# EAGLE design Schematic (EAGLE 5.09)
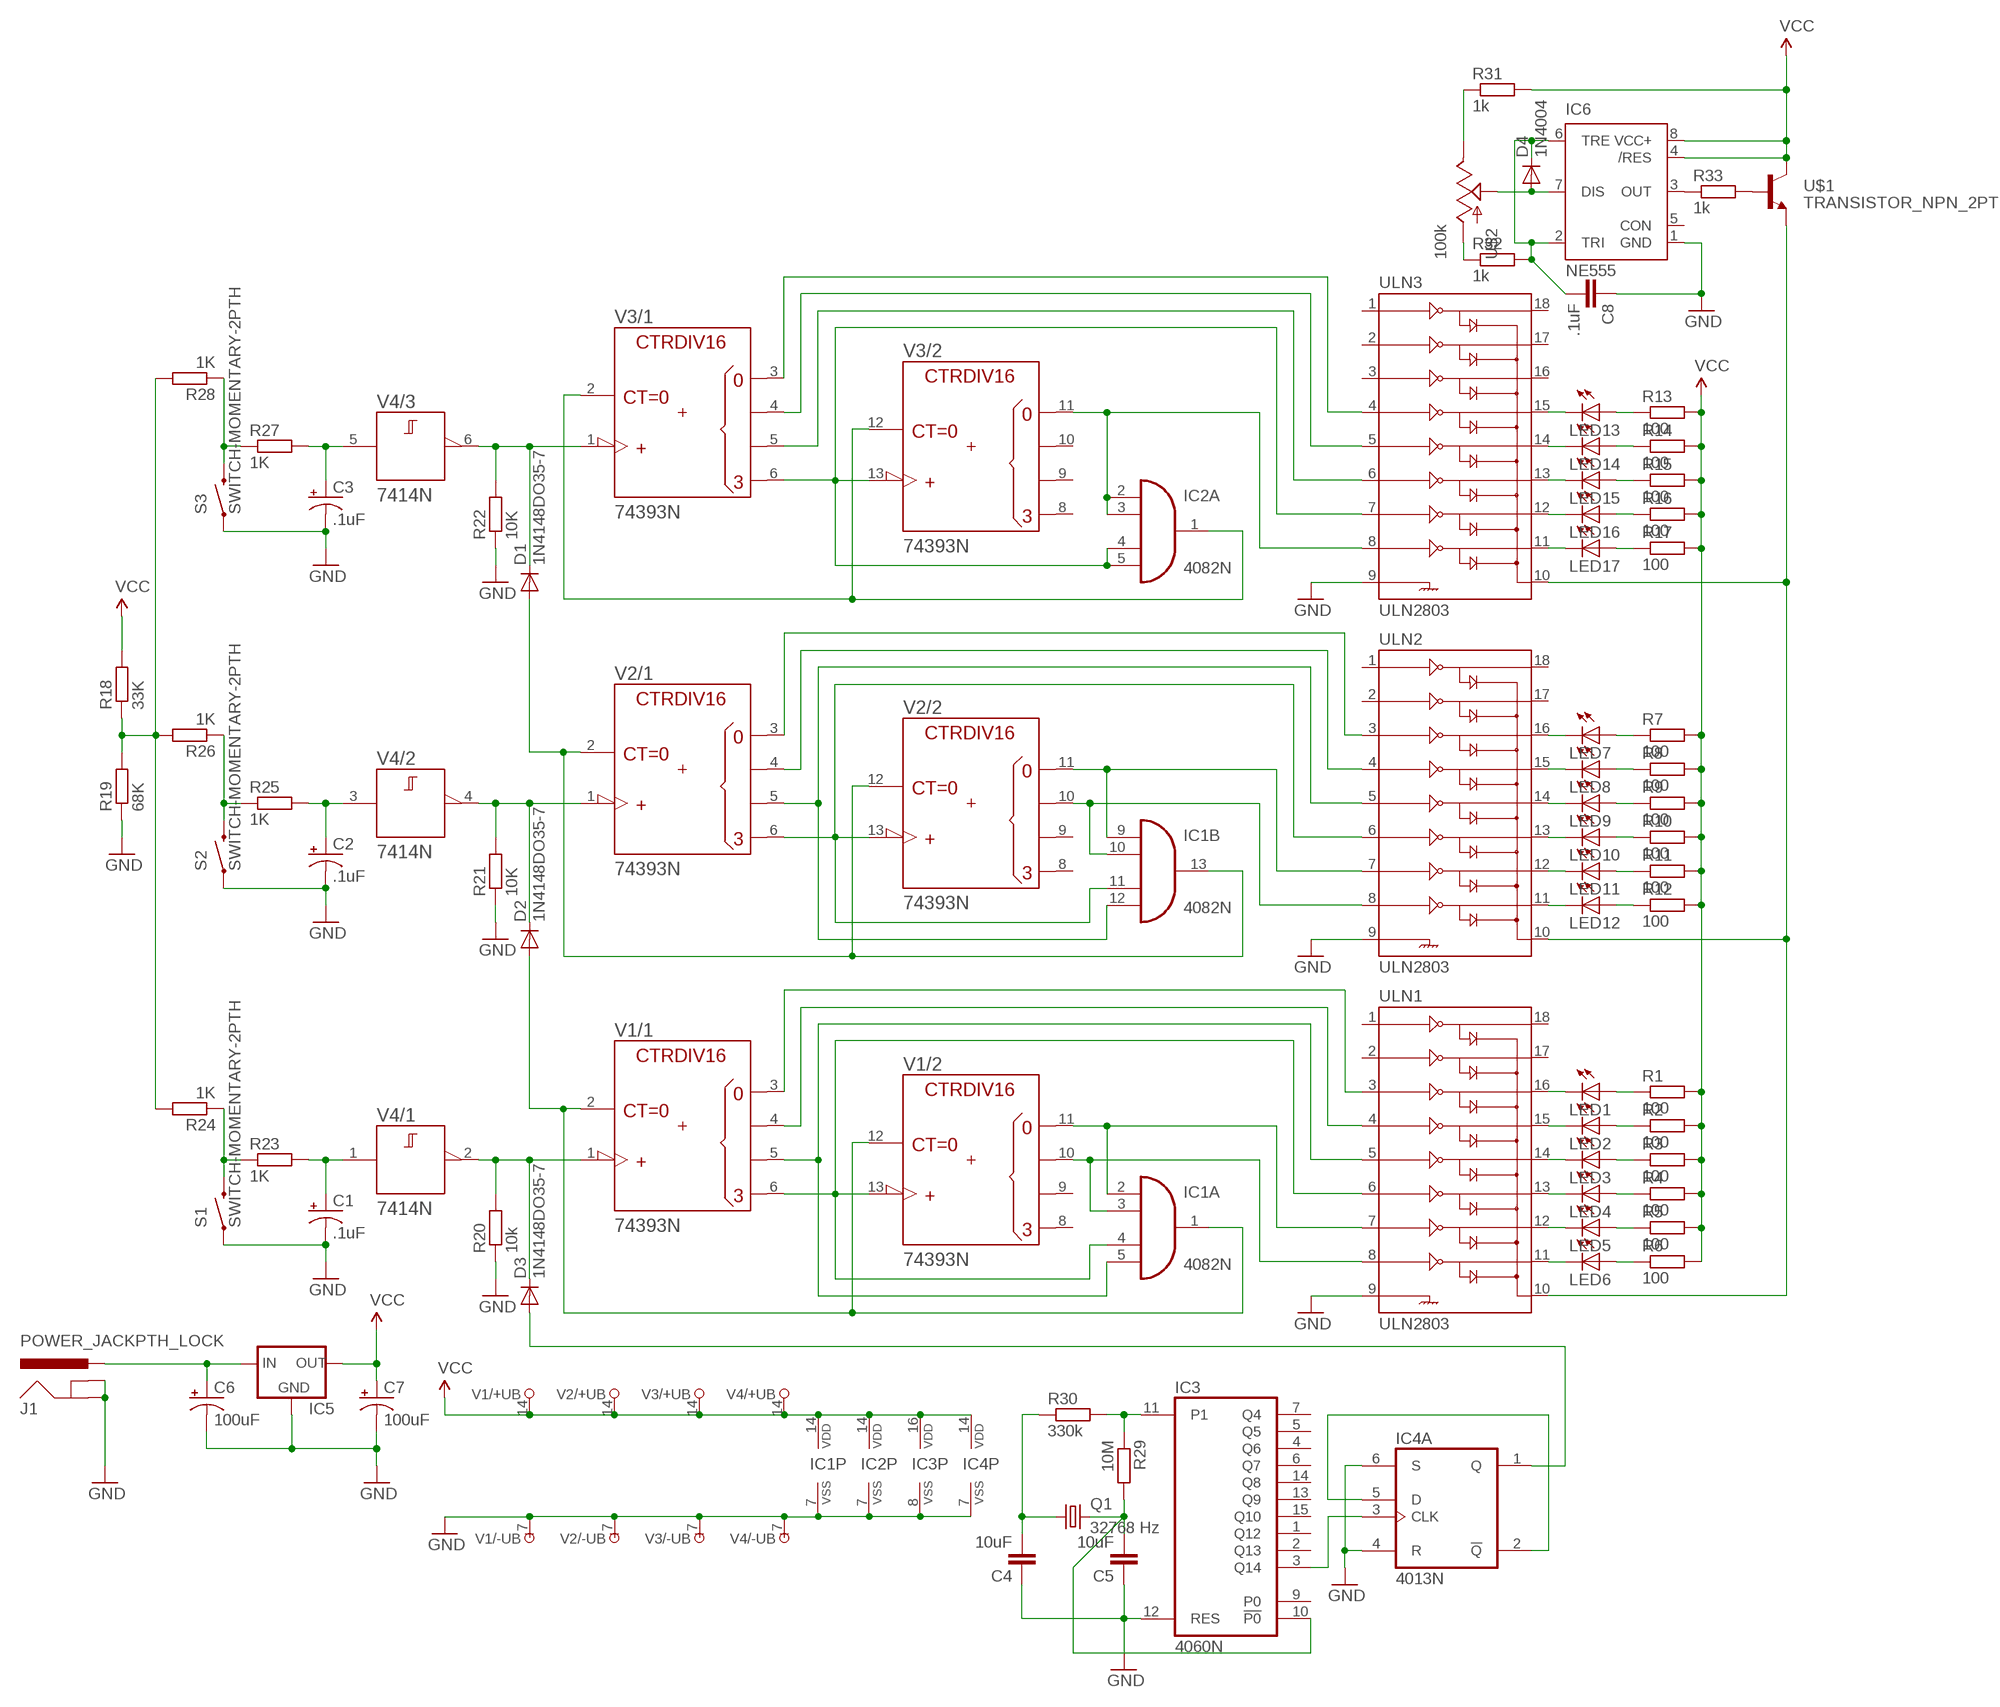
[diagram p0: schematic, sheet 1]

## Parts
C1  .1uF  CAP_POLPTH2  [CPOL-RADIAL-10UF-25V]
C2  .1uF  CAP_POLPTH2  [CPOL-RADIAL-10UF-25V]
C3  .1uF  CAP_POLPTH2  [CPOL-RADIAL-10UF-25V]
C4  10uF  CAPPTH  [CAP-PTH-SMALL]
C5  10uF  CAPPTH  [CAP-PTH-SMALL]
C6  100uF  CAP_POLPTH1  [CPOL-RADIAL-100UF-25V]
C7  100uF  CAP_POLPTH1  [CPOL-RADIAL-100UF-25V]
C8  .1uF  CAPPTH  [CAP-PTH-SMALL]
D1  1N4148DO35-7  DIODE-D-5  [D-5]
D2  1N4148DO35-7  DIODE-D-5  [D-5]
D3  1N4148DO35-7  DIODE-D-5  [D-5]
D4  1N4004  DIODE-D-5  [D-5]
IC1  4082N  [DIL14]
IC2  4082N  [DIL14]
IC3  4060N  [DIL16]
IC4  4013N  [DIL14]
IC5  V_REG_78XXSIDE  [78XXL]
IC6  NE555  [DIL-08]
J1  POWER_JACKPTH_LOCK  [POWER_JACK_PTH_LOCK]
LED1  LED5MM  [LED5MM]
LED2  LED5MM  [LED5MM]
LED3  LED5MM  [LED5MM]
LED4  LED5MM  [LED5MM]
LED5  LED5MM  [LED5MM]
LED6  LED5MM  [LED5MM]
LED7  LED5MM  [LED5MM]
LED8  LED5MM  [LED5MM]
LED9  LED5MM  [LED5MM]
LED10  LED5MM  [LED5MM]
LED11  LED5MM  [LED5MM]
LED12  LED5MM  [LED5MM]
LED13  LED5MM  [LED5MM]
LED14  LED5MM  [LED5MM]
LED15  LED5MM  [LED5MM]
LED16  LED5MM  [LED5MM]
LED17  LED5MM  [LED5MM]
Q1  32768 Hz  CRYSTALTC26V  [TC26V]
R1  100  R-EU_0204/7  [0204/7]
R2  100  R-EU_0204/7  [0204/7]
R3  100  R-EU_0204/7  [0204/7]
R4  100  R-EU_0204/7  [0204/7]
R5  100  R-EU_0204/7  [0204/7]
R6  100  R-EU_0204/7  [0204/7]
R7  100  R-EU_0204/7  [0204/7]
R8  100  R-EU_0204/7  [0204/7]
R9  100  R-EU_0204/7  [0204/7]
R10  100  R-EU_0204/7  [0204/7]
R11  100  R-EU_0204/7  [0204/7]
R12  100  R-EU_0204/7  [0204/7]
R13  100  R-EU_0204/7  [0204/7]
R14  100  R-EU_0204/7  [0204/7]
R15  100  R-EU_0204/7  [0204/7]
R16  100  R-EU_0204/7  [0204/7]
R17  100  R-EU_0204/7  [0204/7]
R18  33K  R-EU_0204/7  [0204/7]
R19  68K  R-EU_0204/7  [0204/7]
R20  10k  R-EU_0204/7  [0204/7]
R21  10K  R-EU_0204/7  [0204/7]
R22  10K  R-EU_0204/7  [0204/7]
R23  1K  R-EU_0204/7  [0204/7]
R24  1K  R-EU_0204/7  [0204/7]
R25  1K  R-EU_0204/7  [0204/7]
R26  1K  R-EU_0204/7  [0204/7]
R27  1K  R-EU_0204/7  [0204/7]
R28  1K  R-EU_0204/7  [0204/7]
R29  10M  R-EU_0204/7  [0204/7]
R30  330k  R-EU_0204/7  [0204/7]
R31  1k  R-EU_0204/7  [0204/7]
R32  1k  R-EU_0204/7  [0204/7]
R33  1k  R-EU_0204/7  [0204/7]
S1  SWITCH-MOMENTARY-2PTH  [TACTILE-PTH]
S2  SWITCH-MOMENTARY-2PTH  [TACTILE-PTH]
S3  SWITCH-MOMENTARY-2PTH  [TACTILE-PTH]
U$1  TRANSISTOR_NPN_2PTH  [TO-92]
U$2  100k  POT  [ALPS_POT]
ULN1  ULN2803  ULN2803DIP  [DIL18]
ULN2  ULN2803  ULN2803DIP  [DIL18]
ULN3  ULN2803  ULN2803DIP  [DIL18]
V1  74393N  [DIL14]
V2  74393N  [DIL14]
V3  74393N  [DIL14]
V4  7414N  [DIL14]

## Nets
GND: C1.2(-) C2.2(-) C3.2(-) C4.1 C5.1 C6.2(-) C7.2(-) C8.1 IC1.7(P:VSS) IC2.7(P:VSS) IC3.8(VSS) IC3.12(RES) IC4.4(A:R) IC4.6(A:S) IC4.7(P:VSS) IC5.GND IC6.1(GND) J1.GND J1.GNDBREAK R19.1 R20.1 R21.1 R22.1 S1.1 S2.1 S3.1 ULN1.9 ULN2.9 ULN3.9 V1.7(/-UB:-UB) V2.7(/-UB:-UB) V3.7(/-UB:-UB) V4.7(/-UB:-UB)
N$1: IC1.2(A:I0) ULN1.7 V1.11(/2:QA)
N$2: ULN1.3 V1.3(/1:QA)
N$3: IC1.5(A:I3) ULN1.5 V1.5(/1:QC)
N$4: IC1.3(A:I1) ULN1.8 V1.10(/2:QB)
N$5: R31.1 U$2.P$1(E)
N$6: LED2.A R2.1
N$7: ULN2.4 V2.4(/1:QB)
N$8: ULN2.3 V2.3(/1:QA)
N$9: LED1.A R1.1
N$10: LED3.A R3.1
N$11: LED4.A R4.1
N$12: LED5.A R5.1
N$13: LED6.A R6.1
N$14: R25.1 R26.1 S2.3
N$15: IC1.12(B:I3) ULN2.5 V2.5(/1:QC)
N$16: IC1.11(B:I2) ULN2.6 V2.6(/1:QD) V2.13(/2:A)
N$17: IC1.9(B:I0) ULN2.7 V2.11(/2:QA)
N$18: LED17.K(C) ULN3.11
N$19: LED16.K(C) ULN3.12
N$20: IC1.10(B:I1) ULN2.8 V2.10(/2:QB)
N$21: LED15.K(C) ULN3.13
N$22: LED14.K(C) ULN3.14
N$23: LED13.K(C) ULN3.15
N$24: LED13.A R13.1
N$25: IC2.2(A:I0) IC2.3(A:I1) ULN3.8 V3.11(/2:QA)
N$26: ULN3.5 V3.4(/1:QB)
N$27: ULN3.6 V3.5(/1:QC)
N$28: R27.1 R28.1 S3.3
N$29: IC2.4(A:I2) IC2.5(A:I3) ULN3.7 V3.6(/1:QD) V3.13(/2:A)
N$30: LED14.A R14.1
N$31: ULN3.4 V3.3(/1:QA)
N$32: LED15.A R15.1
N$33: LED16.A R16.1
N$34: LED17.A R17.1
N$35: IC4.2(A:!Q) IC4.5(A:D)
N$36: LED7.K(C) ULN2.16
N$37: LED8.K(C) ULN2.15
N$38: LED9.K(C) ULN2.14
N$39: LED10.K(C) ULN2.13
N$40: LED11.K(C) ULN2.12
N$41: C2.1(+) R25.2 V4.3(/2:A)
N$42: IC3.3(Q14) IC4.3(A:CLK)
N$43: R18.1 R19.2 R24.2 R26.2 R28.2
N$44: R23.1 R24.1 S1.3
N$45: D2.C R21.2 V2.1(/1:A) V4.4(/2:Y)
N$46: IC3.11(P1) R29.1 R30.2
N$47: D2.A IC1.1(A:O) V1.2(/1:CLR) V1.12(/2:CLR)
N$48: C6.1(+) IC5.IN J1.PWR
N$49: D1.A IC1.13(B:O) V2.2(/1:CLR) V2.12(/2:CLR)
N$50: C3.1(+) R27.2 V4.5(/3:A)
N$51: C1.1(+) R23.2 V4.1(/1:A)
N$52: D3.A IC4.1(A:Q)
N$53: IC2.1(A:O) V3.2(/1:CLR) V3.12(/2:CLR)
N$54: LED12.K(C) ULN2.11
N$55: C5.2 IC3.10(!P0) Q1.2 R29.2
N$56: C4.2 Q1.1 R30.1
N$57: D1.C R22.2 V3.1(/1:A) V4.6(/3:Y)
N$58: IC1.4(A:I2) ULN1.6 V1.6(/1:QD) V1.13(/2:A)
N$59: D3.C R20.2 V1.1(/1:A) V4.2(/1:Y)
N$60: ULN1.4 V1.4(/1:QB)
N$61: LED7.A R7.1
N$62: LED8.A R8.1
N$63: LED9.A R9.1
N$64: LED10.A R10.1
N$65: LED11.A R11.1
N$66: LED12.A R12.1
N$67: R32.1 U$2.P$3(A)
N$69: D4.A IC6.7(DIS) U$2.P$2(S)
N$70: LED6.K(C) ULN1.11
N$71: LED5.K(C) ULN1.12
N$72: U$1.3(E) ULN1.10 ULN2.10 ULN3.10
N$74: LED4.K(C) ULN1.13
N$75: LED3.K(C) ULN1.14
N$76: LED2.K(C) ULN1.15
N$77: LED1.K(C) ULN1.16
N$78: R33.2 U$1.2(B)
N$80: IC6.3(OUT) R33.1
N$81: C8.2 D4.C IC6.2(TRI) IC6.6(TRE) R32.2
VCC: C7.1(+) IC1.14(P:VDD) IC2.14(P:VDD) IC3.16(VDD) IC4.14(P:VDD) IC5.OUT IC6.4(/RES) IC6.8(VCC+) R1.2 R2.2 R3.2 R4.2 R5.2 R6.2 R7.2 R8.2 R9.2 R10.2 R11.2 R12.2 R13.2 R14.2 R15.2 R16.2 R17.2 R18.2 R31.2 U$1.1(C) V1.14(/+UB:+UB) V2.14(/+UB:+UB) V3.14(/+UB:+UB) V4.14(/+UB:+UB)
Unconnected: IC2.9(B:I0) IC2.10(B:I1) IC2.11(B:I2) IC2.12(B:I3) IC2.13(B:O) IC3.1(Q12) IC3.2(Q13) IC3.4(Q6) IC3.5(Q5) IC3.6(Q7) IC3.7(Q4) IC3.9(P0) IC3.13(Q9) IC3.14(Q8) IC3.15(Q10) IC4.8(B:S) IC4.9(B:D) IC4.10(B:R) IC4.11(B:CLK) IC4.12(B:!Q) IC4.13(B:Q) IC6.5(CON) ULN1.1 ULN1.2 ULN1.17 ULN1.18 ULN2.1 ULN2.2 ULN2.17 ULN2.18 ULN3.1 ULN3.2 ULN3.3 ULN3.16 ULN3.17 ULN3.18 V1.8(/2:QD) V1.9(/2:QC) V2.8(/2:QD) V2.9(/2:QC) V3.8(/2:QD) V3.9(/2:QC) V3.10(/2:QB) V4.8(/4:Y) V4.9(/4:A) V4.10(/5:Y) V4.11(/5:A) V4.12(/6:Y) V4.13(/6:A)

## Library data of the parts
C1-C3 C6 C7 = SparkFun:CAP_POL: Capacitor Polarized These are standard SMD and PTH capacitors. Normally 10uF, 47uF, and 100uF in electrolytic and tantalum varieties. Always verify the external diameter of the through hole cap, it varies with capacity, voltage, and manufacturer. The EIA devices should be standard.
C4 C5 C8 = SparkFun:CAP: Capacitor Standard 0603 ceramic capacitor, and 0.1" leaded capacitor.
D1-D4 = diode:DIODE-: DIODE
IC1 IC2 = 40xx:4082: Dual 4-input AND
IC3 = 40xx:4060: 14-stage binary/ripple COUNTER
IC4 = 40xx:4013: Dual D FLIP FLOP, set/reset
IC5 = SparkFun:V_REG_78XX: Voltage Regulator Standard 7805 5V regulator. IGO (Input Ground Output). Spark Fun Electronics SKU : COM-00107
IC6 = st-microelectronics:NE555: General purpose bipolar Timer
J1 = SparkFun:POWER_JACK: Power Jack This is the standard 5.5mm barrel jack for power. The PTH is the most common, proven, reliable, footprint. All others are experimental. The Slot footprint only works if the mill layer is transmitted to the PCB fab house so be warned. Spark Fun Electronics SKU : PRT-00119. Mating wall wart : TOL-00298 (and others)
LED1-LED17 = led:LED: LED OSRAM: - CHIPLED LG R971, LG N971, LY N971, LG Q971, LY Q971, LO R971, LY R971 LH N974, LH R974 LS Q976, LO Q976, LY Q976 LO Q996 - Hyper CHIPLED LW Q18S LB Q993, LB Q99A, LB R99A - SideLED LS A670, LO A670, LY A670, LG A670, LP A670 LB A673, LV A673, LT A673, LW A673 LH A674 LY A675 LS A676, LA A676, LO A676, LY A676, LW A676 LS A679, LY A679, LG A679 - Hyper Micro SIDELED® LS Y876, LA Y876, LO Y876, LY Y876 LT Y87S - SmartLED LW L88C, LW L88S LB L89C, LB L89S, LG L890 LS L89K, LO L89K, LY L89K LS L896, LA L896, LO L896, LY L896 - TOPLED LS T670, LO T670, LY T670, LG T670, LP T670 LSG T670, LSP T670, LSY T670, LOP T670, LYG T670 LG T671, LOG T671, LSG T671 LB T673, LV T673, LT T673, LW T673 LH T674 LS T676, LA T676, LO T676, LY T676, LB T676, LH T676, LSB T676, LW T676 LB T67C, LV T67C, LT T67C, LS T67K, LO T67K, LY T67K, LW E67C LS E67B, LA E67B, LO E67B, LY E67B, LB E67C, LV E67C, LT E67C LW T67C LS T679, LY T679, LG T679 LS T770, LO T770, LY T770, LG T770, LP T770 LB T773, LV T773, LT T773, LW T773 LH T774 LS E675, LA E675, LY E675, LS T675 LS T776, LA T776, LO T776, LY T776, LB T776 LHGB T686 LT T68C, LB T68C - Hyper Mini TOPLED® LB M676 - Mini TOPLED Santana® LG M470 LS M47K, LO M47K, LY M47K Source: http://www.osram.convergy.de LUXEON: - LUMILED® LXK2-PW12-R00, LXK2-PW12-S00, LXK2-PW14-U00, LXK2-PW14-V00 LXK2-PM12-R00, LXK2-PM12-S00, LXK2-PM14-U00 LXK2-PE12-Q00, LXK2-PE12-R00, LXK2-PE12-S00, LXK2-PE14-T00, LXK2-PE14-U00 LXK2-PB12-K00, LXK2-PB12-L00, LXK2-PB12-M00, LXK2-PB14-N00, LXK2-PB14-P00, LXK2-PB14-Q00 LXK2-PR12-L00, LXK2-PR12-M00, LXK2-PR14-Q00, LXK2-PR14-R00 LXK2-PD12-Q00, LXK2-PD12-R00, LXK2-PD12-S00 LXK2-PH12-R00, LXK2-PH12-S00 LXK2-PL12-P00, LXK2-PL12-Q00, LXK2-PL12-R00 Source: www.luxeon.com KINGBRIGHT: KA-3528ASYC Source: www.kingbright.com
Q1 = crystal:CRYSTAL: CRYSTAL
R1-R33 = rcl:R-EU_: RESISTOR, European symbol
S1-S3 = SparkFun:SWITCH-MOMENTARY-2
U$1 = SparkFun:TRANSISTOR_NPN_2
U$2 = SparkFun:POT
ULN1-ULN3 = SparkFun:ULN2803: Darlington Driver ULN2803 Darlington array. 500mA max per channel, 8-channel package. Spark Fun Electronics SKU : COM-00312
V1-V3 = 74ttl-din:74*393: Dual 4-bit decade and binary COUNTER
V4 = 74ttl-din:74*14: Hex schmitt trigger INVERTER

## Board
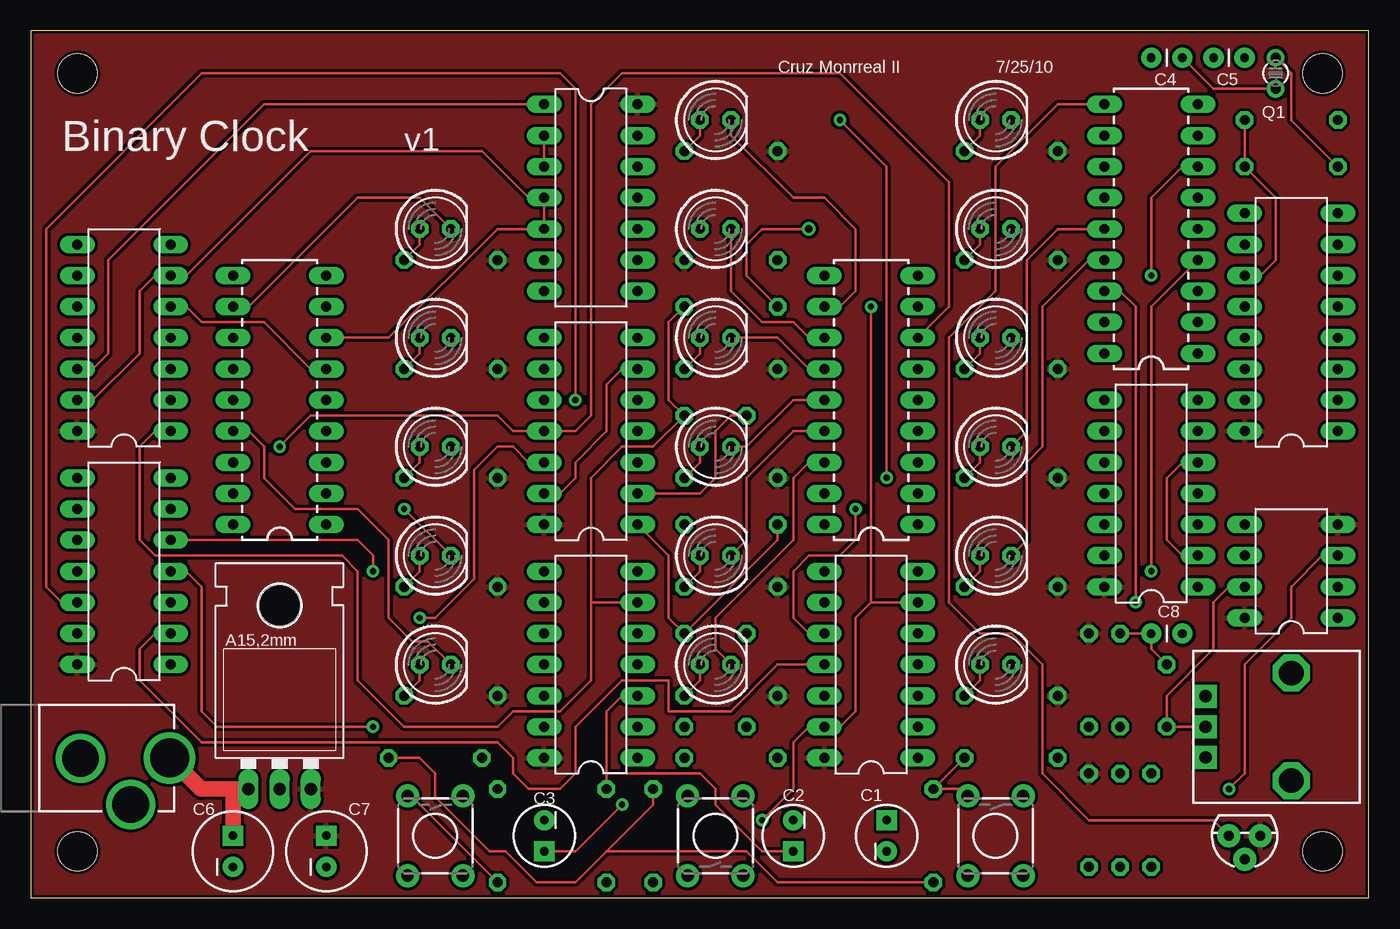
[diagram p1: board, top side]
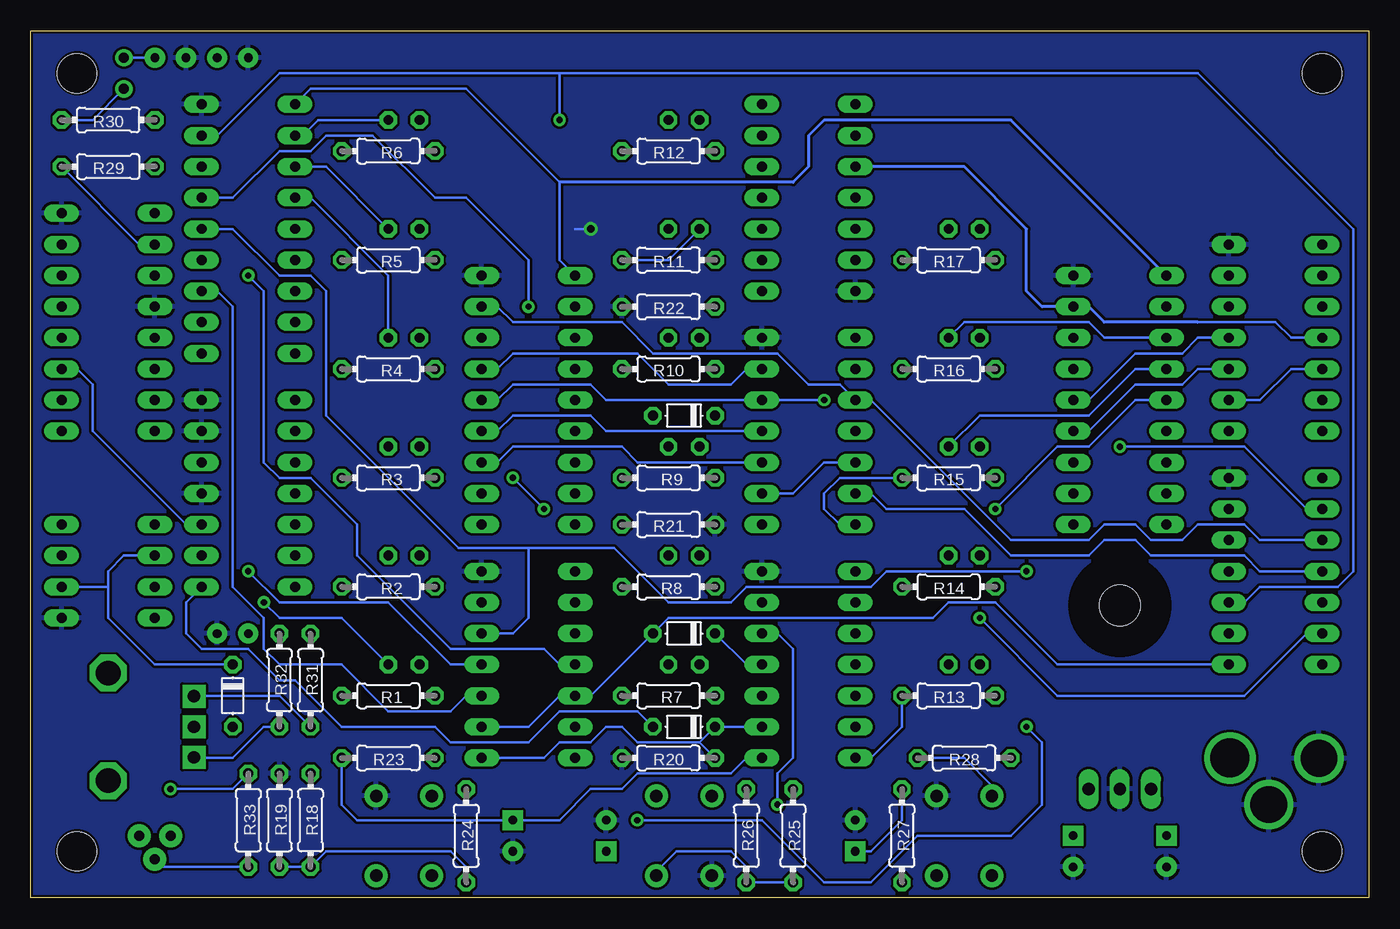
[diagram p2: board, bottom side, seen from below]

Size 109.2 x 70.79 mm. Coordinates in mm from the lower left corner, seen from the top.
Outline: 0,0 109.2,0 109.2,70.79 0,70.79 0,0
Copper layers (1*16): Top 0.035mm / dielectric 1.5mm / Bottom 0.035mm
Design rules "SparkFun *": minimum track width 8mil, minimum drill 20mil, track to track 8mil, track to pad 8mil, pad to pad 8mil, via to via 8mil, smd to smd 8mil, copper to edge 8mil, drill to drill 8mil, minimum pad ring 12mil, minimum via ring 10mil, stop-mask expansion 4mil, vias tented up to drill 25mil, thermal gap 10mil
Holes 3.2 mm at 3.81,3.81 105.41,67.31 3.81,67.31 105.41,3.81

### Footprints (pad centres in the part's own frame; a part is rotated, then mirrored left to right if it is on the bottom)
CPOL-RADIAL-10UF-25V = drill 0.7 pad 1.651 square: 1 1.27,0 | drill 0.7 pad 1.651 round: 2 -1.27,0
CAP-PTH-SMALL = drill 0.7 pad 1.651 round: 1 0,0; 2 2.54,0
CPOL-RADIAL-100UF-25V = drill 0.7 pad 1.651 square: 1 1.27,0 | drill 0.7 pad 1.651 round: 2 -1.27,0
D-5 = drill 0.813 octagon: A 2.54,0; C -2.54,0
DIL14 = drill 0.813 long: 1 -7.62,-3.81; 2 -5.08,-3.81; 3 -2.54,-3.81; 4 0,-3.81; 5 2.54,-3.81; 6 5.08,-3.81; 7 7.62,-3.81; 8 7.62,3.81; 9 5.08,3.81; 10 2.54,3.81; 11 0,3.81; 12 -2.54,3.81; 13 -5.08,3.81; 14 -7.62,3.81
DIL16 = drill 0.813 long: 1 -8.89,-3.81; 2 -6.35,-3.81; 3 -3.81,-3.81; 4 -1.27,-3.81; 5 1.27,-3.81; 6 3.81,-3.81; 7 6.35,-3.81; 8 8.89,-3.81; 9 8.89,3.81; 10 6.35,3.81; 11 3.81,3.81; 12 1.27,3.81; 13 -1.27,3.81; 14 -3.81,3.81; 15 -6.35,3.81; 16 -8.89,3.81
78XXL = drill 1.016 long: GND 0,-3.81; IN -2.54,-3.81; OUT 2.54,-3.81 | hole 3.302: 0,11.176
DIL-08 = drill 0.813 long: 1 -3.81,-3.81; 2 -1.27,-3.81; 3 1.27,-3.81; 4 3.81,-3.81; 5 3.81,3.81; 6 1.27,3.81; 7 -1.27,3.81; 8 -3.81,3.81
POWER_JACK_PTH_LOCK = drill 2.997 round: GND 0.025,6.608; GNDBREAK 3.812,10.7 | drill 3.2 round: PWR 0,13.878
LED5MM = drill 0.813 octagon: A -1.27,0; K 1.27,0
TC26V = drill 0.813 round: 1 -1.27,0; 2 1.27,0
0204/7 = drill 0.813 octagon: 1 -3.81,0; 2 3.81,0
TACTILE-PTH = drill 1.016 pad 1.88 round: 1 -3.251,2.261; 2 3.251,2.261; 3 -3.251,-2.261; 4 3.251,-2.261
TO-92 = drill 0.813 pad 1.88 round: 1 -1.27,0; 2 0,1.905; 3 1.27,0
ALPS_POT = drill 1 pad 1.88 square: P$1 7,-2.5; P$2 7,0; P$3 7,2.5 | drill 2 octagon: P$4 0,-4.4; P$5 0,4.4
DIL18 = drill 0.813 long: 1 -10.16,-3.81; 2 -7.62,-3.81; 3 -5.08,-3.81; 4 -2.54,-3.81; 5 0,-3.81; 6 2.54,-3.81; 7 5.08,-3.81; 8 7.62,-3.81; 9 10.16,-3.81; 10 10.16,3.81; 11 7.62,3.81; 12 5.08,3.81; 13 2.54,3.81; 14 0,3.81; 15 -2.54,3.81; 16 -5.08,3.81; 17 -7.62,3.81; 18 -10.16,3.81

### Placement (x,y rotation side)
C1  69.85,5.08 90 top
C2  62.23,5.08 270 top
C3  41.91,5.08 270 top
C4  91.44,68.58 0 top
C5  96.52,68.58 0 top
C6  16.51,3.81 90 top
C7  24.13,3.81 90 top
C8  93.98,21.59 180 top
D1  55.88,39.37 180 bottom
D2  55.88,21.59 180 bottom
D3  55.88,13.97 180 bottom
D4  92.71,16.51 270 bottom
IC1  7.62,26.67 90 top
IC2  45.72,57.15 270 top
IC3  102.87,46.99 90 top
IC4  91.44,33.02 90 top
IC5  20.32,12.7 0 top
IC6  102.87,26.67 90 top
J1  -2.54,11.43 270 top
LED1  78.74,19.05 0 top
LED2  78.74,27.94 0 top
LED3  78.74,36.83 0 top
LED4  78.74,45.72 0 top
LED5  78.74,54.61 0 top
LED6  78.74,63.5 0 top
LED7  55.88,19.05 0 top
LED8  55.88,27.94 0 top
LED9  55.88,36.83 0 top
LED10  55.88,45.72 0 top
LED11  55.88,54.61 0 top
LED12  55.88,63.5 0 top
LED13  33.02,19.05 0 top
LED14  33.02,27.94 0 top
LED15  33.02,36.83 0 top
LED16  33.02,45.72 0 top
LED17  33.02,54.61 0 top
Q1  101.6,67.31 90 top
R1  80.01,16.51 180 bottom
R2  80.01,25.4 180 bottom
R3  80.01,34.29 180 bottom
R4  80.01,43.18 180 bottom
R5  80.01,52.07 180 bottom
R6  80.01,60.96 180 bottom
R7  57.15,16.51 180 bottom
R8  57.15,25.4 180 bottom
R9  57.15,34.29 180 bottom
R10  57.15,43.18 180 bottom
R11  57.15,52.07 0 bottom
R12  57.15,60.96 180 bottom
R13  34.29,16.51 180 bottom
R14  34.29,25.4 180 bottom
R15  34.29,34.29 180 bottom
R16  34.29,43.18 180 bottom
R17  34.29,52.07 180 bottom
R18  86.36,6.35 90 bottom
R19  88.9,6.35 270 bottom
R20  57.15,11.43 0 bottom
R21  57.15,30.48 180 bottom
R22  57.15,48.26 0 bottom
R23  80.01,11.43 180 bottom
R24  73.66,5.08 270 bottom
R25  46.99,5.08 90 bottom
R26  50.8,5.08 90 bottom
R27  38.1,5.08 90 bottom
R28  33.02,11.43 0 bottom
R29  102.87,59.69 180 bottom
R30  102.87,63.5 0 bottom
R31  86.36,17.78 90 bottom
R32  88.9,17.78 90 bottom
R33  91.44,6.35 270 bottom
S1  78.74,5.08 270 top
S2  55.88,5.08 90 top
S3  33.02,5.08 270 top
U$1  99.06,5.08 180 top
U$2  102.87,13.97 180 top
ULN1  91.44,54.61 90 top
ULN2  68.58,40.64 90 top
ULN3  20.32,40.64 90 top
V1  68.58,19.05 90 top
V2  45.72,38.1 90 top
V3  7.62,45.72 90 top
V4  45.72,19.05 90 top

### Tracks (layer width: path | path; a pad name or v marks a point on that pad's centre or on a via)
GND  (via drill 0.6)
  Top 0.203: R22.1 58.42,50.8 58.42,53.34 59.69,54.61 v63.5,54.61
  Bottom 0.203: v63.5,54.61 64.77,54.61
  pour Bottom: 0,71.12 109.22,71.12 109.22,0 0,0
N$1  (via drill 0.51)
  Top 0.203: IC1.2 10.16,21.59 8.89,20.32 8.89,17.78 13.97,12.7 38.1,12.7 39.37,11.43 39.37,10.16 40.64,8.89 43.18,8.89 44.45,10.16 44.45,13.97 48.26,17.78 52.07,17.78 52.07,15.24 57.15,15.24 60.96,19.05 V1.11 | ULN1.7 93.98,59.69 91.44,57.15 v91.44,50.8
  Bottom 0.203: v91.44,50.8 90.17,49.53 90.17,35.56 88.9,34.29 86.36,34.29 82.55,30.48 82.55,27.94 74.93,20.32 67.31,20.32 66.04,19.05 V1.11
N$2
  Bottom 0.203: V1.3 73.66,16.51 74.93,15.24 80.01,15.24 83.82,19.05 88.9,19.05 90.17,20.32 90.17,22.86 92.71,25.4 92.71,48.26 93.98,49.53 ULN1.3
N$3  (via drill 0.51)
  Top 0.203: IC1.5 26.67,29.21 27.94,27.94 v27.94,26.67
  Bottom 0.203: v27.94,26.67 39.37,26.67 40.64,25.4 50.8,25.4 52.07,24.13 57.15,24.13 61.59,28.57 68.58,28.57 | 68.58,28.57 68.58,22.86 69.85,21.59 V1.5 | ULN1.5 92.71,54.61 88.9,50.8 86.36,50.8 85.09,49.53 85.09,39.37 74.3,28.57 68.58,28.57
N$4  (via drill 0.51)
  Top 0.203: V1.10 63.5,21.59 62.23,22.86 62.23,26.67 63.5,27.94 66.04,27.94 67.31,29.21 v67.31,31.75 | v66.04,63.5 69.85,59.69 v69.85,34.29
  Bottom 0.203: IC1.3 10.16,24.13 8.89,25.4 2.54,25.4 1.27,26.67 1.27,54.61 13.97,67.31 66.04,67.31 | 66.04,67.31 88.9,67.31 93.98,62.23 ULN1.8 | v69.85,34.29 v67.31,31.75 | 66.04,67.31 v66.04,63.5
N$5
  Bottom 0.203: R31.1 88.9,16.51 95.25,16.51 U$2.P$1
N$6
  Top 0.203: R2.1 77.47,26.67 LED2.A
N$7
  Bottom 0.203: V2.4 62.23,38.1 63.5,39.37 69.85,39.37 71.12,38.1 ULN2.4
N$8
  Bottom 0.203: V2.3 59.69,35.56 60.96,36.83 69.85,36.83 71.12,35.56 ULN2.3
N$9
  Top 0.203: R1.1 77.47,17.78 LED1.A
N$10
  Top 0.203: R3.1 77.47,35.56 LED3.A
N$11
  Top 0.203: R4.1 77.47,44.45 LED4.A
N$12
  Top 0.203: R5.1 77.47,53.34 LED5.A
N$13
  Top 0.203: R6.1 77.47,62.23 LED6.A
N$14
  Bottom 0.203: R25.1 R26.1 50.8,2.54 52.07,3.81 56.52,3.81 58.14,2.18 S2.3
N$15  (via drill 0.51)
  Top 0.203: IC1.12 2.54,24.13 1.27,25.4 1.27,54.61 13.97,67.31 43.18,67.31 44.45,66.04 v44.45,40.64
  Bottom 0.203: v44.45,40.64 V2.5 62.23,40.64 63.5,41.91 69.85,41.91 71.12,40.64 ULN2.5
N$16
  Top 0.203: V2.6 48.26,43.18 46.99,41.91 46.99,38.1 44.45,35.56 44.45,34.29 43.18,33.02 V2.13
  Bottom 0.203: IC1.11 8.89,26.67 10.16,27.94 17.78,27.94 19.05,29.21 21.59,29.21 22.86,27.94 29.21,27.94 33.02,31.75 39.37,31.75 40.64,33.02 V2.13 | ULN2.6 71.12,43.18 69.85,44.45 59.69,44.45 57.15,41.91 52.07,41.91 50.8,43.18 V2.6
N$17  (via drill 0.51)
  Top 0.203: v20.32,36.83 22.86,39.37 38.1,39.37 39.37,38.1 V2.11 44.45,38.1 45.72,39.37 45.72,64.77 48.26,67.31 66.04,67.31 74.93,58.42 74.93,48.26 ULN2.7
  Bottom 0.203: IC1.9 5.08,31.75 10.16,36.83 v20.32,36.83
N$18
  Top 0.203: ULN3.11 17.78,48.26 26.67,57.15 31.75,57.15 LED17.K
N$19
  Bottom 0.203: ULN3.12 21.59,45.72 22.86,46.99 33.02,46.99 LED16.K
N$20
  Bottom 0.203: IC1.10 8.89,29.21 10.16,30.48 13.97,30.48 15.24,29.21 17.78,29.21 19.05,30.48 21.59,30.48 22.86,29.21 29.21,29.21 40.64,40.64 V2.10 43.18,41.91 45.72,41.91 48.26,44.45 58.42,44.45 60.96,46.99 69.85,46.99 71.12,48.26 ULN2.8
N$21
  Bottom 0.203: ULN3.13 19.05,43.18 22.86,39.37 31.75,39.37 LED15.K
N$22  (via drill 0.51)
  Top 0.203: v30.48,31.75 LED14.K
  Bottom 0.203: ULN3.14 19.05,40.64 22.86,36.83 25.4,36.83 v30.48,31.75
N$23
  Top 0.203: LED13.K 32.38,20.95 31.11,20.95 29.21,22.86 29.21,29.21 26.67,31.75 21.59,31.75 19.05,34.29 19.05,36.83 17.78,38.1 ULN3.15
N$24
  Top 0.203: R13.1 31.75,17.78 LED13.A
N$25
  Top 0.203: IC2.3 IC2.2
  Bottom 0.203: V3.11 6.35,45.72 7.62,46.99 13.97,46.99
  Bottom 0.254: 13.97,46.99 21.59,46.99 22.86,48.26 ULN3.8 26.67,48.26 27.94,49.53 27.94,54.61 33.02,59.69 IC2.3
N$26
  Bottom 0.203: V3.4 13.97,45.72 15.24,44.45 19.05,44.45 22.86,40.64 ULN3.5
N$27
  Top 0.203: V3.5 12.7,48.26 13.97,46.99 19.05,46.99 22.86,43.18 ULN3.6
N$28
  Top 0.203: R27.1 31.04,8.33 S3.3
  Bottom 0.203: R28.1 33.02,11.43 30.76,9.17 S3.3
N$29
  Top 0.203: V3.13 5.08,40.64 8.89,44.45 8.89,49.53 10.16,50.8 V3.6 12.7,50.8 22.86,60.96 36.83,60.96 40.64,57.15 IC2.4 IC2.5 38.1,54.61 29.21,45.72 ULN3.7
N$30
  Top 0.203: R14.1 31.75,26.67 LED14.A
N$31
  Bottom 0.203: V3.3 13.97,43.18 15.24,41.91 19.05,41.91 22.86,38.1 ULN3.4
N$32
  Top 0.203: R15.1 31.75,35.56 LED15.A
N$33
  Top 0.203: R16.1 31.75,44.45 LED16.A
N$34
  Top 0.203: R17.1 31.75,53.34 LED17.A
N$35
  Top 0.203: IC4.2 93.98,27.94 92.71,29.21 92.71,34.29 93.98,35.56 IC4.5
N$36
  Top 0.203: LED7.K 55.88,20.32 55.88,22.86 62.23,29.21 62.23,34.29 63.5,35.56 ULN2.16
N$37
  Top 0.203: LED8.K 58.42,29.21 58.42,34.29 62.23,38.1 ULN2.15
N$38
  Top 0.203: LED9.K 58.42,36.83 62.23,40.64 ULN2.14
N$39
  Top 0.203: LED10.K 60.96,45.72 63.5,43.18 ULN2.13
N$40
  Top 0.203: LED11.K 57.15,49.53 59.69,46.99 62.23,46.99 63.5,45.72 ULN2.12
N$41
  Top 0.203: 46.99,10.16 46.99,15.24 48.26,16.51 V4.3 | R25.2 46.99,10.16 | C2.1 59.69,3.81 55.88,7.62 55.88,8.89 54.61,10.16 46.99,10.16
N$42
  Bottom 0.203: IC4.3 96.52,30.48 104.14,38.1 104.14,41.91 105.41,43.18 IC3.3
N$43
  Top 0.203: R28.2 31.75,11.43 33.02,10.16 33.02,8.26 37.47,3.81 38.73,3.81 41.27,1.27 44.45,1.27 46.99,3.81 | R24.2 60.96,1.27 58.42,3.81 46.99,3.81 | 46.99,3.81 50.8,7.62 R26.2
  Bottom 0.203: R24.2 73.66,2.54 74.93,3.81 85.09,3.81 R18.1 R19.2
N$44
  Top 0.203: S1.3 75.92,8.89 R24.1 R23.1
N$45
  Top 0.203: V2.1 52.07,27.94 52.07,22.86 D2.C 60.96,29.21 R21.2
  Bottom 0.203: V4.4 50.8,19.05 D2.C
N$46
  Top 0.203: R30.2 R29.1 101.6,57.15 101.6,52.07 100.33,50.8 IC3.11
N$47
  Bottom 0.203: IC1.1 25.4,19.05 30.48,24.13 34.29,24.13 35.56,22.86 57.15,22.86 D2.A 63.5,16.51 V1.12 66.04,16.51 68.58,13.97 V1.2
N$48
  Top 1.27: 16.51,8.89 13.88,8.89 J1.PWR | 16.51,8.89 IC5.IN | C6.1 16.51,8.89
N$49  (via drill 0.51)
  Top 0.203: v31.75,22.86 33.02,22.86 36.2,26.04 36.2,34.92 38.1,36.83 39.37,36.83 40.64,35.56 V2.12 | D1.A 57.15,39.37 55.88,38.1 55.88,34.29 54.61,33.02 V2.2
  Bottom 0.203: IC1.13 5.08,21.59 10.16,16.51 25.4,16.51 v31.75,22.86 | V2.2 46.99,33.02 44.45,35.56 V2.12
N$50  (via drill 0.51)
  Top 0.203: v48.26,7.62 44.45,3.81 C3.1
  Bottom 0.203: R27.2 38.1,6.35 40.64,3.81 C3.1 | V4.5 48.26,21.59 46.99,20.32 46.99,11.43 48.26,10.16 v48.26,7.62
N$51
  Bottom 0.203: V4.1 50.8,11.43 52.07,10.16 59.69,10.16 60.96,8.89 63.5,8.89 66.04,6.35 C1.1 82.55,6.35 83.82,7.62 R23.2
N$52
  Bottom 0.203: D3.A 59.69,15.24 66.04,15.24 68.58,12.7 74.93,12.7 76.2,13.97 83.82,13.97 87.63,17.78 88.9,17.78 91.44,20.32 95.25,20.32 96.52,21.59 96.52,24.13 IC4.1
N$53
  Top 0.203: IC2.1 19.05,64.77 6.35,52.07 6.35,44.45 5.08,43.18 V3.12
  Bottom 0.203: V3.12 6.35,43.18 8.89,40.64 V3.2
N$54
  Top 0.203: ULN2.11 66.04,48.26 67.31,49.53 67.31,54.61 64.77,57.15 62.23,57.15 57.15,62.23 LED12.K
N$55
  Top 0.203: Q1.2 102.87,67.31 102.87,63.5 R29.2
  Bottom 0.203: IC3.10 100.33,53.34 R29.2 | Q1.2 C5.2
N$56
  Top 0.203: C4.2 96.52,66.04 Q1.1
  Bottom 0.203: Q1.1 104.14,63.5 R30.1
N$57
  Top 0.203: R22.2 52.07,46.99 52.07,40.64 D1.C 50.8,36.83 48.26,36.83 45.72,34.29 45.72,24.13 | V3.1 10.16,38.1 8.89,36.83 8.89,29.21 10.16,27.94 25.4,27.94 26.67,26.67 26.67,17.78 30.48,13.97 38.1,13.97 39.37,15.24 43.18,15.24 45.72,17.78 45.72,24.13 | 45.72,24.13 V4.6
N$58  (via drill 0.51)
  Top 0.203: IC1.4 12.7,26.67 13.97,25.4 13.97,15.24 15.24,13.97 v27.94,13.97 | v59.69,6.35 62.23,8.89 62.23,12.7 63.5,13.97 V1.13 66.04,13.97 67.31,15.24 67.31,22.86 68.58,24.13 | 68.58,24.13 V1.6 | 68.58,24.13 v68.58,48.26
  Bottom 0.203: v27.94,13.97 26.67,12.7 26.67,7.62 29.21,5.08 36.83,5.08 40.64,1.27 44.45,1.27 49.53,6.35 v59.69,6.35 | ULN1.6 92.71,57.15 88.9,60.96 86.36,60.96 85.09,62.23 81.28,62.23 76.2,57.15 73.66,57.15 68.58,52.07 v68.58,48.26
N$59
  Bottom 0.203: V1.1 67.31,11.43 66.04,12.7 63.5,12.7 62.23,13.97 60.96,13.97 59.69,12.7 54.61,12.7 | 54.61,12.7 D3.C V4.2 | 54.61,12.7 R20.2
N$60  (via drill 0.51)
  Top 0.203: v91.44,26.67 91.44,48.26 ULN1.4
  Bottom 0.203: V1.4 74.93,19.05 80.01,24.13 88.9,24.13 v91.44,26.67
N$61
  Top 0.203: R7.1 54.61,17.78 LED7.A
N$62
  Top 0.203: R8.1 54.61,26.67 LED8.A
N$63
  Top 0.203: R9.1 54.61,35.56 LED9.A
N$64
  Top 0.203: R10.1 54.61,44.45 LED10.A
N$65
  Bottom 0.203: LED11.A 57.15,52.07 R11.1
N$66
  Top 0.203: R12.1 54.61,62.23 LED12.A
N$67
  Bottom 0.203: R32.1 90.17,13.97 92.71,11.43 95.25,11.43 U$2.P$3
N$69
  Top 0.203: U$2.P$2 D4.A 92.71,16.51 96.52,20.32 96.52,24.13 97.79,25.4 IC6.7
N$70
  Bottom 0.203: LED6.K 85.72,63.5 87,62.23 ULN1.11
N$71
  Bottom 0.203: LED5.K 85.09,59.69 ULN1.12
N$72
  Top 0.203: U$1.3 96.52,6.35 86.36,6.35 82.55,10.16 82.55,19.05 80.01,21.59 77.47,21.59 74.93,24.13 74.93,45.72 78.74,49.53 78.74,59.69 83.82,64.77 ULN1.10
  Bottom 0.203: ULN2.10 66.04,52.07 66.04,58.42 73.66,66.04 86.36,66.04 ULN1.10
  Bottom 0.254: 66.04,58.42 46.99,58.42 45.72,59.69 45.72,62.23 44.45,63.5 29.21,63.5 ULN3.10
N$74
  Bottom 0.203: LED4.K 80.01,50.8 86.36,57.15 ULN1.13
N$75
  Top 0.203: LED3.K 81.28,38.1 81.28,52.07 83.82,54.61 ULN1.14
N$76
  Top 0.203: LED2.K 81.28,29.21 81.28,35.56 82.55,36.83 82.55,48.26 86.36,52.07 ULN1.15
N$77  (via drill 0.51)
  Top 0.203: v90.17,24.13 90.17,48.26 88.9,49.53 ULN1.16
  Bottom 0.203: LED1.K 83.82,22.86 88.9,22.86 v90.17,24.13
N$78
  Bottom 0.203: R33.2 98.42,2.54 U$1.2
N$80  (via drill 0.51)
  Top 0.203: v97.79,8.89 99.06,10.16 99.06,19.05 102.87,22.86 102.87,25.4 105.41,27.94 IC6.3
  Bottom 0.203: R33.1 92.71,8.89 v97.79,8.89
N$81
  Top 0.203: R32.2 C8.2 91.44,20.32 D4.C
  Bottom 0.203: IC6.6 101.6,27.94 102.87,26.67 102.87,25.4 | D4.C 99.06,19.05 102.87,22.86 102.87,25.4 | 102.87,25.4 IC6.2
VCC
  Bottom 0.203: R15.2 43.18,34.29 44.45,33.02 44.45,31.75 43.18,30.48 V2.14 | R13.2 38.1,13.97 40.64,11.43 V4.14
  pour Top (isolate 0.254): 0,71.12 109.22,71.12 109.22,0 0,0

### Text on the board
tPlace: Cruz Monrreal II | 7/25/10 | Binary Clock | v1